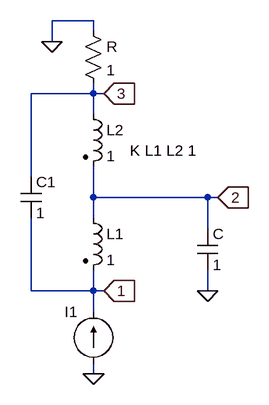
[diagram p0: schematic CS-T-Coil.asc]
CS-T-Coil.asc, the LTspice schematic file:
Version 4
SHEET 1 880 680
WIRE 80 -80 16 -80
WIRE 80 -64 80 -80
WIRE 16 -48 16 -80
WIRE 80 32 80 16
WIRE 80 32 -16 32
WIRE 96 32 80 32
WIRE 80 64 80 32
WIRE -16 160 -16 32
WIRE 80 192 80 144
WIRE 256 192 80 192
WIRE 272 192 256 192
WIRE 80 224 80 192
WIRE 256 240 256 192
WIRE -16 336 -16 224
WIRE 80 336 80 304
WIRE 80 336 -16 336
WIRE 96 336 80 336
WIRE 256 336 256 304
WIRE 80 368 80 336
WIRE 80 464 80 448
FLAG 256 336 0
FLAG 96 336 1
IOPIN 96 336 In
FLAG 272 192 2
IOPIN 272 192 In
FLAG 96 32 3
IOPIN 96 32 In
FLAG 80 464 0
FLAG 16 -48 0
SYMBOL ind2 64 208 R0
SYMATTR InstName L1
SYMATTR Value 1
SYMATTR Type ind
SYMBOL ind2 64 48 R0
SYMATTR InstName L2
SYMATTR Value 1
SYMATTR Type ind
SYMBOL res 64 -80 R0
SYMATTR InstName R
SYMATTR Value 1
SYMBOL cap -32 160 R0
SYMATTR InstName C1
SYMATTR Value 1
SYMBOL cap 240 240 R0
SYMATTR InstName C
SYMATTR Value 1
SYMBOL current 80 448 R180
WINDOW 0 24 80 Left 2
WINDOW 3 24 0 Invisible 2
WINDOW 123 0 0 Left 0
WINDOW 39 0 0 Left 0
SYMATTR InstName I1
SYMATTR Value 1
TEXT 136 120 Left 2 !K L1 L2 1

The netlist it stands for:
* CS-T-Coil.asc
L1 2 1 1
L2 3 2 1
R 0 3 1
C1 3 1 1
C 2 0 1
I1 0 1 1
K L1 L2 1
.backanno
.end